# EAGLE design untitled (EAGLE 6.3)
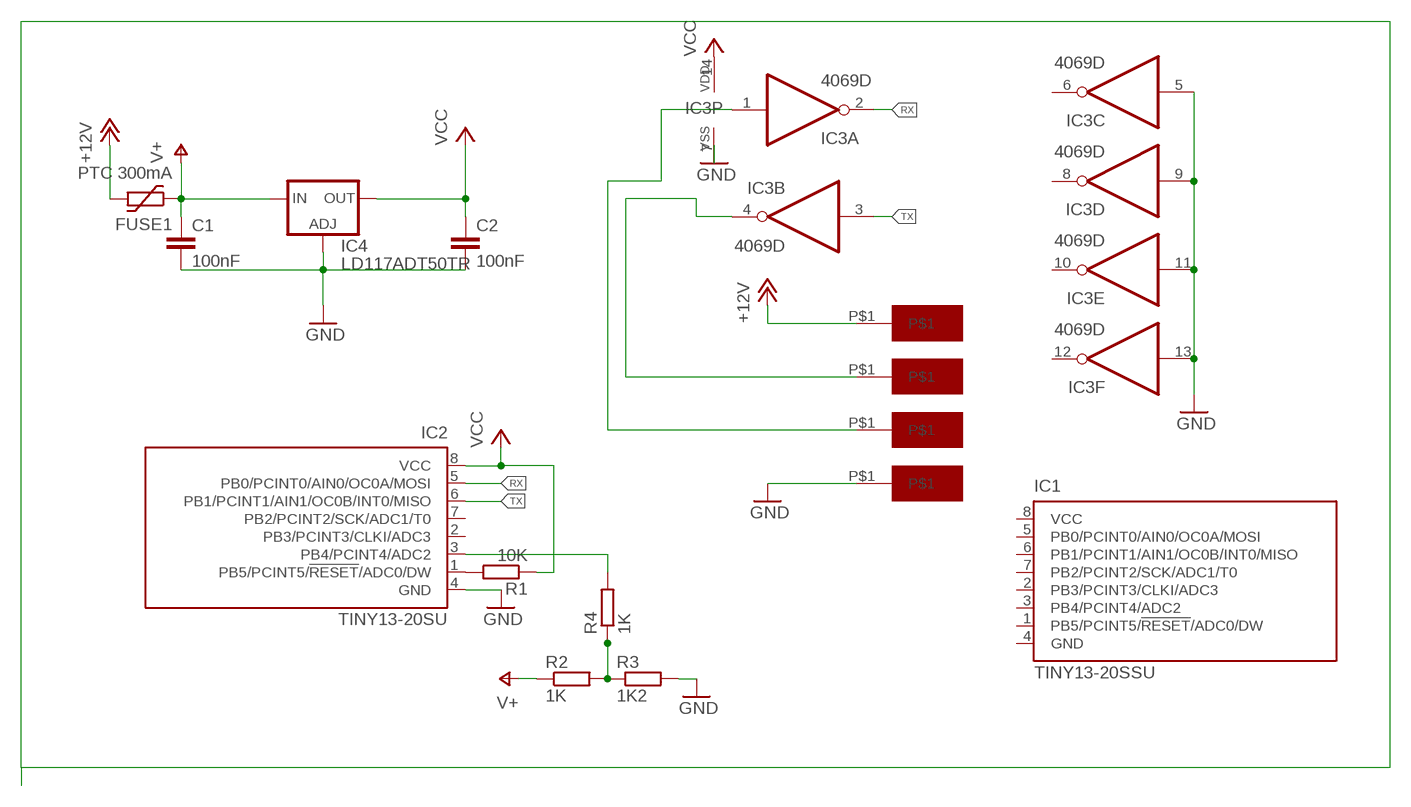
[diagram p0: schematic, sheet 1]

## Parts
C1  100nF  C-EUC0805  [C0805]
C2  100nF  C-EUC0805  [C0805]
FUSE1  PTC 300mA  1206L  [1206L]
IC1  TINY13-20SSU  [8S1]
IC2  TINY13-20SU  [8S2]
IC3  4069D  [SO14]
IC4  LD117ADT50TR  [DPACK]
R1  10K  R-EU_R0805  [R0805]
R2  1K  R-EU_R0805  [R0805]
R3  1K2  R-EU_R0805  [R0805]
R4  1K  R-EU_R0805  [R0805]
U$1  WIRE_PAD_SMD  [WIRE_SMD_PAD]
U$2  WIRE_PAD_SMD  [WIRE_SMD_PAD]
U$3  WIRE_PAD_SMD  [WIRE_SMD_PAD]
U$4  WIRE_PAD_SMD  [WIRE_SMD_PAD]

## Nets
+12V: FUSE1.P$2 U$1.P$1
GND: C1.2 C2.2 IC2.4(GND) IC3.5(C:I) IC3.7(P:VSS) IC3.9(D:I) IC3.11(E:I) IC3.13(F:I) IC4.1(ADJ) R3.2 U$4.P$1
N$1: IC2.1(PB5/PCINT5/!RESET!/ADC0/DW) R1.2
N$8: R2.2 R3.1 R4.1
N$9: IC2.3(PB4/PCINT4/ADC2) R4.2
N$29: IC3.4(B:O) U$2.P$1
N$30: IC3.1(A:I) U$3.P$1
RX: IC2.5(PB0/PCINT0/AIN0/OC0A/MOSI) IC3.2(A:O)
TX: IC2.6(PB1/PCINT1/AIN1/OC0B/INT0/MISO) IC3.3(B:I)
V+: C1.1 FUSE1.P$1 IC4.3(IN) R2.1
VCC: C2.1 IC2.8(VCC) IC3.14(P:VDD) IC4.4(OUT) R1.1
Unconnected: IC1.1(PB5/PCINT5/!RESET!/ADC0/DW) IC1.2(PB3/PCINT3/CLKI/ADC3) IC1.3(PB4/PCINT4/ADC2) IC1.5(PB0/PCINT0/AIN0/OC0A/MOSI) IC1.6(PB1/PCINT1/AIN1/OC0B/INT0/MISO) IC1.7(PB2/PCINT2/SCK/ADC1/T0) IC2.2(PB3/PCINT3/CLKI/ADC3) IC2.7(PB2/PCINT2/SCK/ADC1/T0) IC3.6(C:O) IC3.8(D:O) IC3.10(E:O) IC3.12(F:O)

## Power pins joined to a net without a drawn wire
GND: IC1.4(GND)
VCC: IC1.8(VCC)

## Library data of the parts
C1 C2 = rcl_rigel:C-EU: CAPACITOR, European symbol
FUSE1 = ptc-littlefuse:1206L
IC1 IC2 = ATMEL:TINY13: 8-bit AVR Microcontroller with 1K Bytes In-System Programmable Flash Source: http://www.atmel.com/dyn/resources/prod_documents/2535S.pdf; MPN: ATTINY13-20SSU; OC_FARNELL: 1455133; OC_NEWARK: 58M3771
IC3 = 40xx:4069: Hex INVERTER
IC4 = v-reg:LD117A?*: Low drop fixed and adjustable positive voltage regulators 1 A Source: http://www.st.com/stonline/products/literature/ds/7194/ld1117axx.pdf
R1-R4 = rcl_rigel:R-EU_: RESISTOR, European symbol
U$1-U$4 = toolbox:WIRE_PAD_SMD

## Board
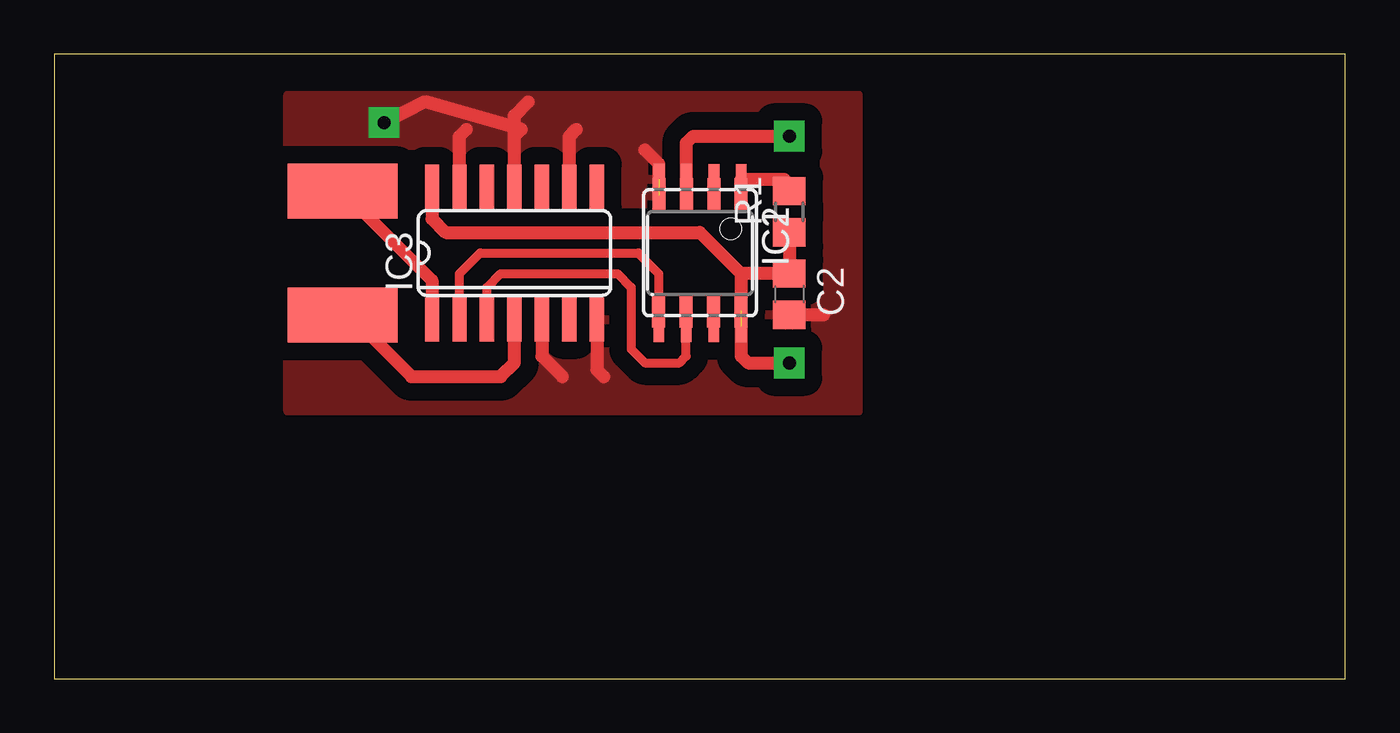
[diagram p1: board, top side]
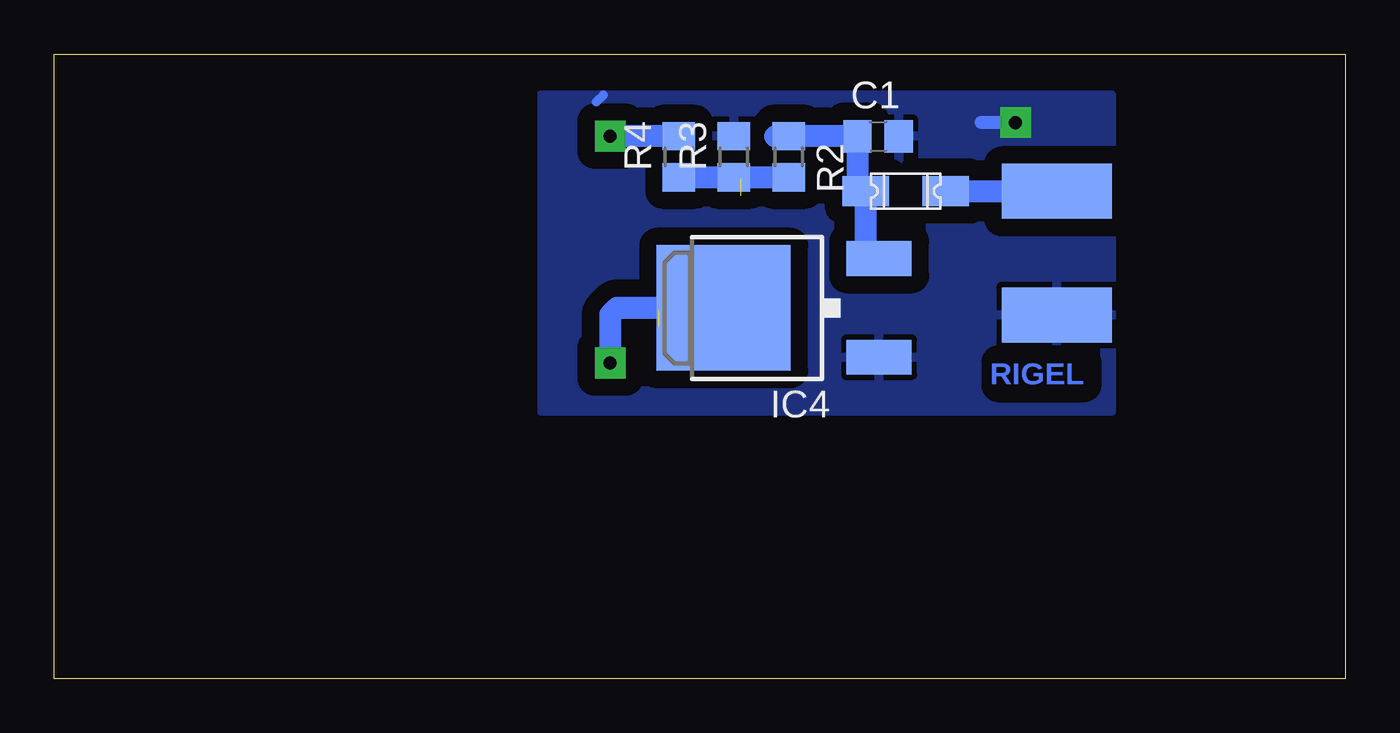
[diagram p2: board, bottom side, seen from below]

Size 59.67 x 28.88 mm. Coordinates in mm from the lower left corner, seen from the top.
Outline: 0,0 59.67,0 59.67,28.88 0,28.88 0,0
Copper layers (1*16): Top 0.035mm / dielectric 1.5mm / Bottom 0.035mm
Design rules "default": minimum track width 10mil, minimum drill 24mil, track to track 8mil, track to pad 8mil, pad to pad 8mil, via to via 8mil, smd to smd 8mil, copper to edge 40mil, drill to drill 8mil, minimum pad ring 10mil, minimum via ring 8mil, stop-mask expansion 4mil, vias tented up to drill 0mil, thermal gap 10mil

### Footprints (pad centres in the part's own frame; a part is rotated, then mirrored left to right if it is on the bottom)
C0805 = smd 1.3 x 1.5: 1 -0.95,0; 2 0.95,0
1206L = smd 2.16 x 1.4: P$1 -1.85,0; P$2 1.85,0
8S1 = smd 0.6 x 1.6: 1 -1.905,-2.654; 2 -0.645,-2.654; 3 0.625,-2.654; 4 1.895,-2.654; 5 1.905,2.654; 6 0.635,2.654; 7 -0.635,2.654; 8 -1.905,2.654
8S2 = smd 0.5 x 1.4: 1 -1.905,-3.404; 2 -0.645,-3.404; 3 0.625,-3.404; 4 1.895,-3.404; 5 1.905,3.404; 6 0.635,3.404; 7 -0.635,3.404; 8 -1.905,3.404
SO14 = smd 0.66 x 2.032: 1 -3.81,-3.073; 2 -2.54,-3.073; 3 -1.27,-3.073; 4 0,-3.073; 5 1.27,-3.073; 6 2.54,-3.073; 7 3.81,-3.073; 8 3.81,3.073; 9 2.54,3.073; 10 1.27,3.073; 11 0,3.073; 12 -1.27,3.073; 13 -2.54,3.073; 14 -3.81,3.073
DPACK = smd 1.6 x 3: 1 -2.28,-4.8; 3 2.28,-4.8 | smd 5.8 x 6.2: 4 0,2.38
R0805 = smd 1.3 x 1.5: 1 -0.95,0; 2 0.95,0
WIRE_SMD_PAD = smd 5.08 x 2.54: P$1 0,0

### Placement (x,y rotation side)
C1  21.59,25.08 0 bottom
C2  33.97,17.78 270 top
FUSE1  20.32,22.54 0 bottom
IC1  29.84,19.68 180 top
IC2  29.84,19.68 180 top
IC3  21.27,19.68 0 top
IC4  26.35,17.14 90 bottom
R1  33.97,21.59 90 top
R2  25.72,24.13 270 bottom
R3  28.26,24.13 90 bottom
R4  30.8,24.13 90 bottom
U$1  13.34,22.54 0 bottom
U$2  13.34,16.83 0 top
U$3  13.34,22.54 0 top
U$4  13.34,16.83 0 bottom

### Tracks (layer width: path | path; a pad name or v marks a point on that pad's centre or on a via)
+12V
  Bottom 1.016: 12.76,21.85 U$1.P$1 FUSE1.P$2
GND  (via drill 0.6 pad 1.42)  (1 unrouted)
  Top 0.61: IC3.7 25.08,14.29 25.4,13.97 | IC3.9 23.81,25.08 24.13,25.4 | IC3.13 18.73,25.08 19.05,25.4 | C2.2 35.24,16.83 35.56,16.83 | IC2.4 27.95,23.8 27.3,24.45 | IC3.5 22.54,14.92 23.5,13.97 | 21.91,26.67 21.27,26.04 IC3.11 21.27,25.08 21.59,25.4 17.14,26.67 v15.24,25.72
  Bottom 0.406: 34.29,26.99 34.61,26.67
  Bottom 0.61: v15.24,25.72 16.83,25.72
  pour Bottom (isolate 0.813): 10.79,26.99 37.15,26.99 37.15,12.38 10.79,12.38
  pour Top (isolate 0.813): 10.79,26.99 37.15,26.99 37.15,12.38 10.79,12.38
N$1
  Top 0.61: IC2.1 33.74,23.09 R1.2
N$8
  Bottom 1.016: R4.1 R3.1 R2.2
N$9  (via drill 0.6 pad 1.42)
  Top 0.61: IC2.3 29.22,24.77 29.53,25.08 v33.97,25.08
  Bottom 1.016: R4.2 v33.97,25.08
N$29
  Top 0.406: U$2.P$1 13.97,16.51
  Top 0.61: 13.97,16.51 16.51,13.97 20.64,13.97 21.27,14.61 IC3.4
N$30
  Top 0.61: U$3.P$1 17.46,18.41 IC3.1
RX
  Top 0.406: IC3.2 18.73,18.73 19.68,19.68 26.99,19.68 27.94,18.73 IC2.5
TX
  Top 0.406: IC3.3 20,18.1 20.64,18.73 26.04,18.73 26.67,18.1 26.67,15.24 27.3,14.61 28.89,14.61 29.21,14.92 IC2.6
V+
  Bottom 1.016: R2.1 26.35,25.08 C1.1 22.54,22.91 FUSE1.P$1 22.17,20.04 IC4.3
VCC  (via drill 0.6 pad 1.42)  (1 unrouted)
  Top 0.61: R1.1 C2.1 31.75,18.73 | 33.66,14.29 v33.97,14.61 32.07,14.61 31.75,14.92 IC2.8 | 31.75,18.73 IC1.8 | IC3.14 17.46,21.27 18.1,20.64 29.84,20.64 31.75,18.73
  Bottom 0.61: 33.66,14.61 v33.97,14.61
  Bottom 1.016: IC4.4 33.66,17.14 33.97,16.83 v33.97,14.61

### Text on the board
Bottom: RIGEL